# Altium schematic sheet Keyboard.SchDoc
size A4; SheetNumber: 7; SheetTotal: 8
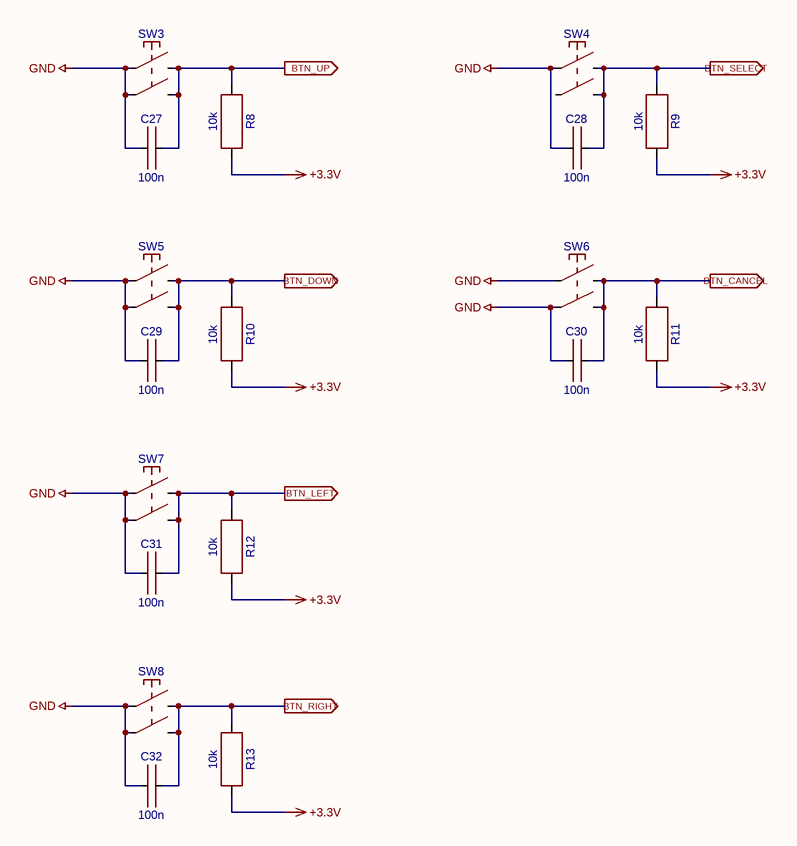
[diagram p0: Keyboard.SchDoc]

## Parts
C27  100n  [CAPC1608X09N]
C28  100n  [CAPC1608X09N]
C29  100n  [CAPC1608X09N]
C30  100n  [CAPC1608X09N]
C31  100n  [CAPC1608X09N]
C32  100n  [CAPC1608X09N]
R8  10k  [RESC2012X05N]
R9  10k  [RESC2012X05N]
R10  10k  [RESC2012X05N]
R11  10k  [RESC2012X05N]
R12  10k  [RESC2012X05N]
R13  10k  [RESC2012X05N]
SW3  KLS7-TS6601-11-180  [KLS7-TS6601-11-180]  (value not drawn)
SW4  KLS7-TS6601-11-180  [KLS7-TS6601-11-180]  (value not drawn)
SW5  KLS7-TS6601-11-180  [KLS7-TS6601-11-180]  (value not drawn)
SW6  KLS7-TS6601-11-180  [KLS7-TS6601-11-180]  (value not drawn)
SW7  KLS7-TS6601-11-180  [KLS7-TS6601-11-180]  (value not drawn)
SW8  KLS7-TS6601-11-180  [KLS7-TS6601-11-180]  (value not drawn)

## Ports
BTN_CANCEL (out), BTN_DOWN (out), BTN_LEFT (out), BTN_RIGHT (out), BTN_SELECT (out), BTN_UP (out)

## Nets
+3.3V: R8.2 R9.2 R10.2 R11.2 R12.2 R13.2
GND: C27.1 C28.1 C29.1 C30.1 C31.1 C32.1 SW3.0 SW3.2 SW4.0 SW5.0 SW5.2 SW6.0 SW6.2 SW7.0 SW7.2 SW8.0 SW8.2
BTN_CANCEL: C30.2 R11.1 SW6.1 SW6.3 ; port BTN_CANCEL
BTN_DOWN: C29.2 R10.1 SW5.1 SW5.3 ; port BTN_DOWN
BTN_LEFT: C31.2 R12.1 SW7.1 SW7.3 ; port BTN_LEFT
BTN_RIGHT: C32.2 R13.1 SW8.1 SW8.3 ; port BTN_RIGHT
BTN_SELECT: C28.2 R9.1 SW4.1 SW4.3 ; port BTN_SELECT
BTN_UP: C27.2 R8.1 SW3.1 SW3.3 ; port BTN_UP

Not connected (* = marked no-connect by the designer): SW4 2

## Library data of the parts
C27-C32 = C0603-100n-25V-X7R-10%: GRM188R71E104KA01D
R8-R13 = R-0805-10k-5%
SW3-SW8 = KLS7-TS6601-11-180: (IT-1102K) Кнопка тактовая прямая 6х6х11мм